# Altium schematic sheet Core&Power.SchDoc
size A3
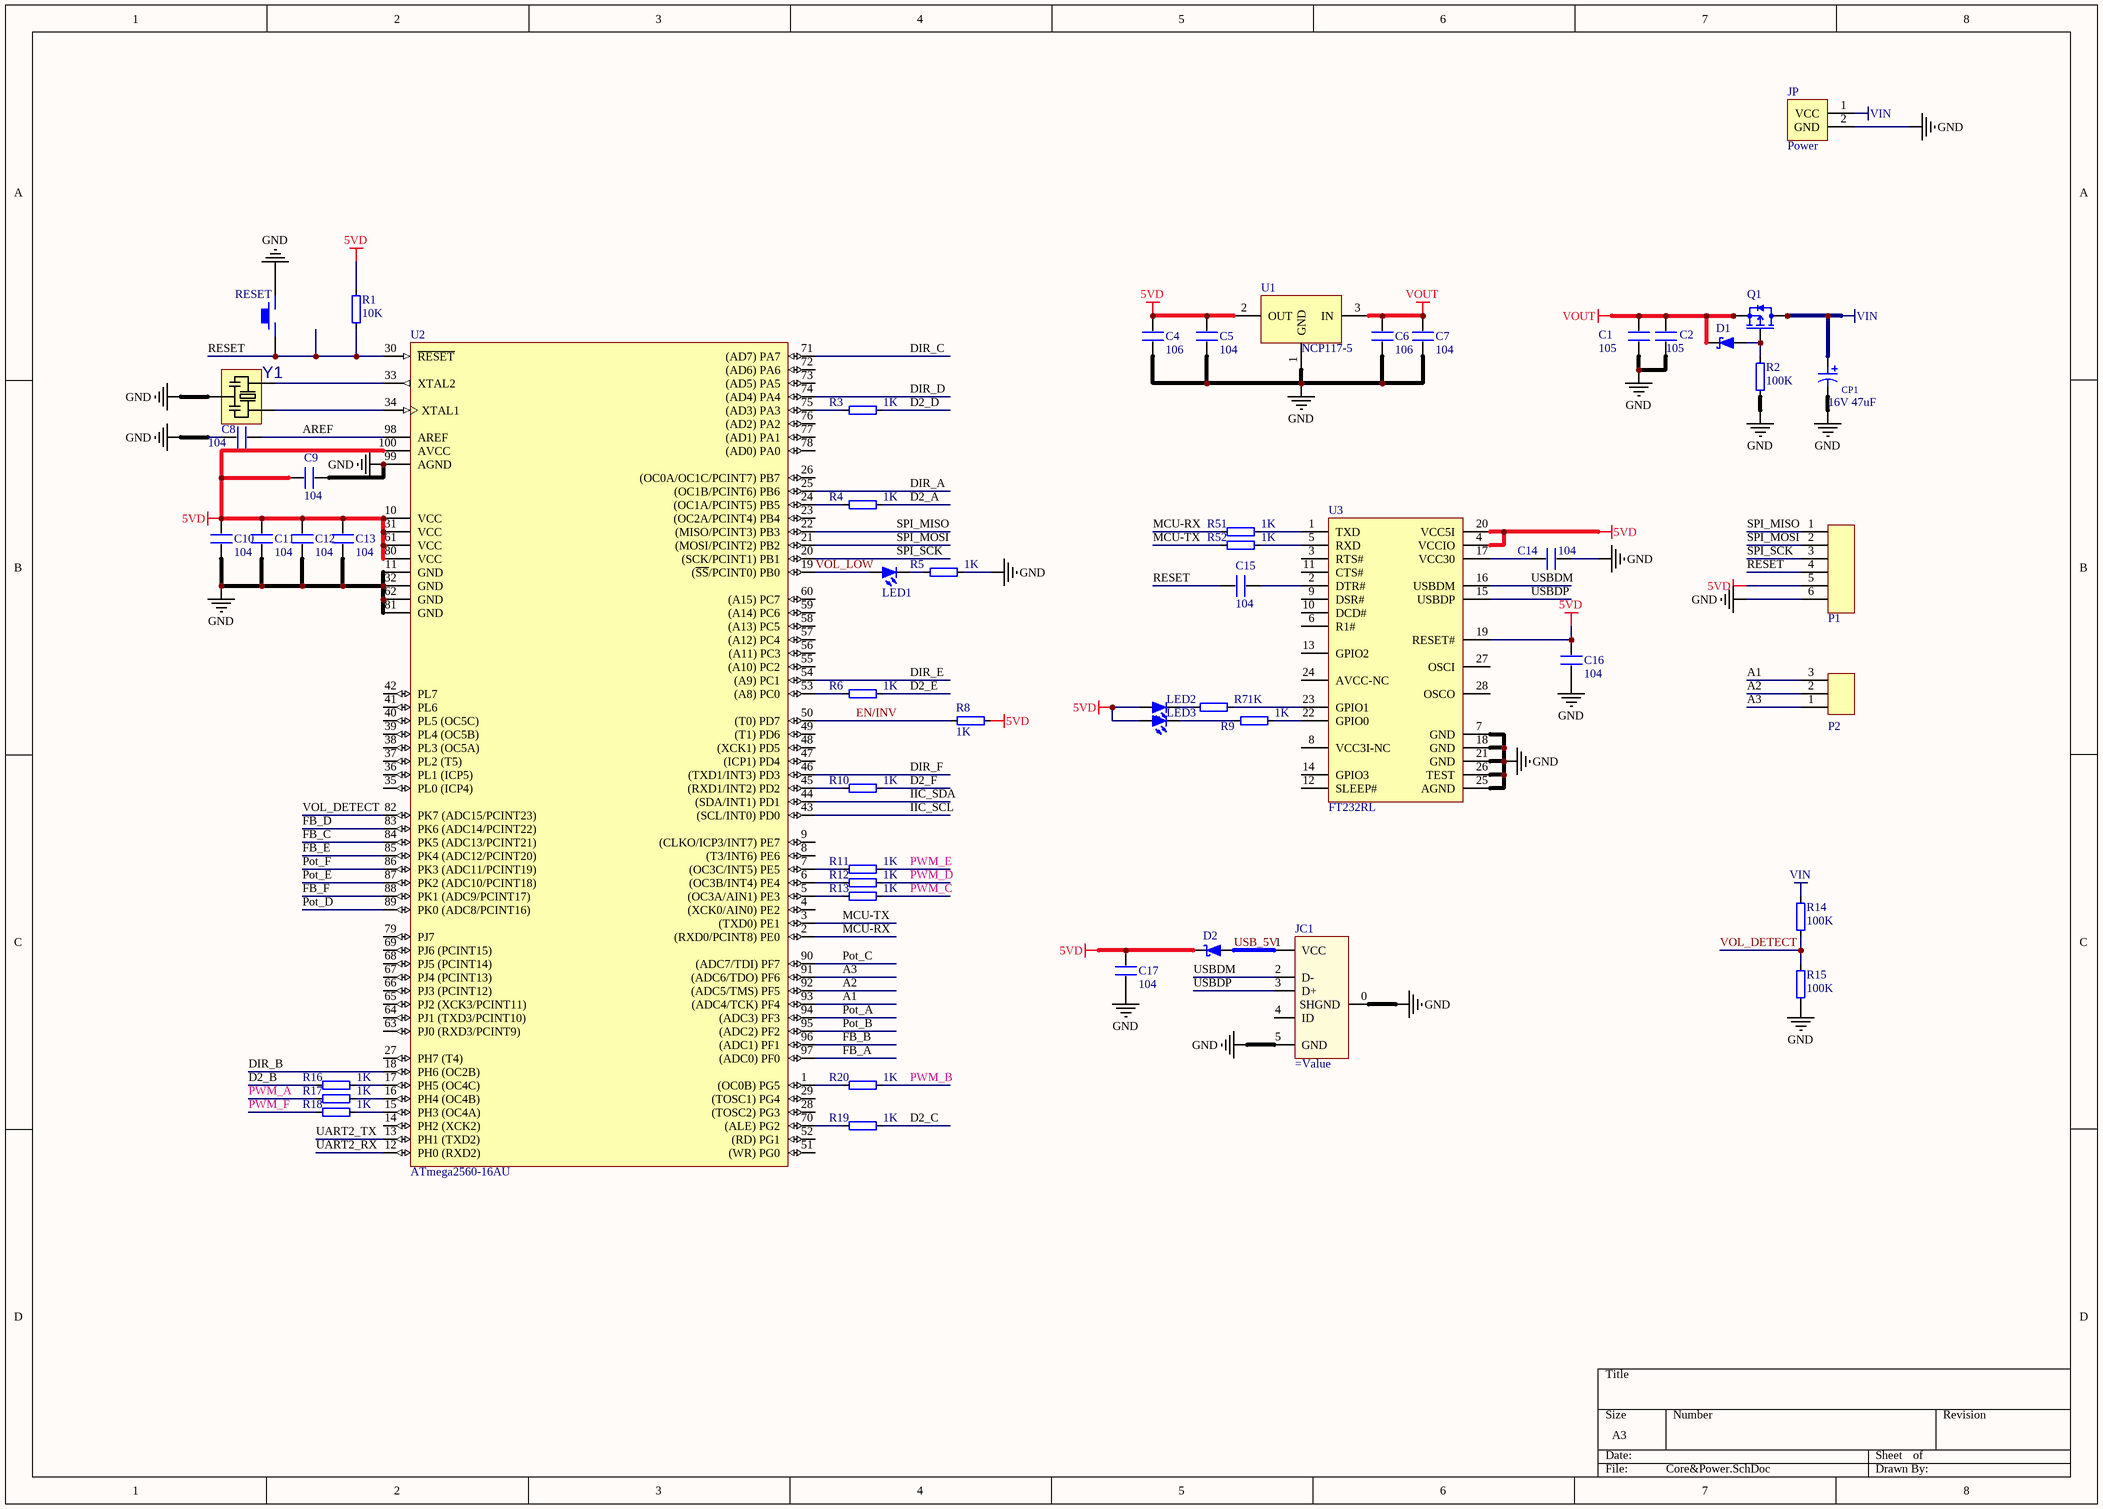
[diagram p0: Core&Power.SchDoc]

## Parts
C1  105  [SM0603C]
C2  105  [SM0603C]
C4  106  [SM0603C]
C5  104  [SM0603C]
C6  106  [SM0603C]
C7  104  [SM0603C]
C8  104  [SM0603C]
C9  104  [SM0603C]
C10  104  [SM0603C]
C11  104  [SM0603C]
C12  104  [SM0603C]
C13  104  [SM0603C]
C14  104  [SM0603C]
C15  104  [SM0603C]
C16  104  [SM0603C]
C17  104  [SM0603C]
CP1  16V 47uF  [SMD5-Al]
D1  B5819W  [SOD-323]  (value not drawn)
D2  B5819W  [SOD-323]  (value not drawn)
JC1  (no value)  [MICRO-USB2]
JP  Power  [AM1015-M]
LED1  Blue LED  [SM0805LED]  (value not drawn)
LED2  Blue LED  [SM0805LED]  (value not drawn)
LED3  Blue LED  [SM0805LED]  (value not drawn)
P1  JC6  [HDR1X6]  (value not drawn)
P2  JC3  [HDR1X3]  (value not drawn)
Q1  (no value)
R1  10K  [SM0603R]
R2  100K  [SM0603R]
R3  1K  [SM0603R]
R4  1K  [SM0603R]
R5  1K  [SM0603R]
R6  1K  [SM0603R]
R7  1K  [SM0603R]
R8  1K  [SM0603R]
R9  1K  [SM0603R]
R10  1K  [SM0603R]
R11  1K  [SM0603R]
R12  1K  [SM0603R]
R13  1K  [SM0603R]
R14  100K  [SM0603R]
R15  100K  [SM0603R]
R16  1K  [SM0603R]
R17  1K  [SM0603R]
R18  1K  [SM0603R]
R19  1K  [SM0603R]
R20  1K  [SM0603R]
R51  1K  [SM0603R]
R52  1K  [SM0603R]
RESET  KEY_M  [SPNO_SMD]  (value not drawn)
U1  NCP117-5  [SOT223-4]
U2  ATmega2560-16AU  [100A_N]
U3  FT232RL  [SSOP-28]
Y1  CSTCE16M0V53-R0  [OSC_CSTCE16M0V53-R0]  (value not drawn)

## Nets
5VD: C4.2 C5.2 C9.2 C10.1 C11.1 C12.1 C13.1 C16.2 C17.2 D2.1(C) LED2.2(A) LED3.2(A) P1.5 R1.2 R8.1 U1.2(OUT) U2.10(VCC) U2.31(VCC) U2.61(VCC) U2.80(VCC) U2.100(AVCC) U3.4(VCCIO) U3.19(RESET#) U3.20(VCC5I)
GND: C1.1 C2.1 C4.1 C5.1 C6.1 C7.1 C8.1 C9.1 C10.2 C11.2 C12.2 C13.2 C14.2 C16.1 C17.1 CP1.2 JC1.0(SHGND) JC1.5(GND) JP.2(GND) P1.6 R2.1 R5.2 R15.1 RESET.1 U1.1(GND) U2.11(GND) U2.32(GND) U2.62(GND) U2.81(GND) U2.99(AGND) U3.7(GND) U3.18(GND) U3.21(GND) U3.25(AGND) U3.26(TEST) Y1.2
VIN: CP1.1 JP.1(VCC) Q1.5(D) Q1.6(D) Q1.7(D) Q1.8(D) R14.2
VOUT: C1.2 C2.2 C6.2 C7.2 D1.1(C) Q1.1(S) Q1.2(S) Q1.3(S) U1.3(IN)
A1: P2.3 U2.93((ADC4/TCK)_PF4)
A2: P2.2 U2.92((ADC5/TMS)_PF5)
A3: P2.1 U2.91((ADC6/TDO)_PF6)
AREF: C8.2 U2.98(AREF)
D2_A: R4.2
D2_B: R16.2
D2_C: R19.2
D2_D: R3.2
D2_E: R6.2
D2_F: R10.2
DIR_A: U2.25((OC1B/PCINT6)_PB6)
DIR_B: U2.18(PH6_(OC2B))
DIR_C: U2.71((AD7)_PA7)
DIR_D: U2.74((AD4)_PA4)
DIR_E: U2.54((A9)_PC1)
DIR_F: U2.46((TXD1/INT3)_PD3)
EN/INV: R8.2 U2.50((T0)_PD7)
FB_A: U2.97((ADC0)_PF0)
FB_B: U2.96((ADC1)_PF1)
FB_C: U2.84(PK5_(ADC13/PCINT21))
FB_D: U2.83(PK6_(ADC14/PCINT22))
FB_E: U2.85(PK4_(ADC12/PCINT20))
FB_F: U2.88(PK1_(ADC9/PCINT17))
IIC_SCL: U2.43((SCL/INT0)_PD0)
IIC_SDA: U2.44((SDA/INT1)_PD1)
MCU-RX: R51.1 U2.2((RXD0/PCINT8)_PE0)
MCU-TX: R52.1 U2.3((TXD0)_PE1)
Pot_A: U2.94((ADC3)_PF3)
Pot_B: U2.95((ADC2)_PF2)
Pot_C: U2.90((ADC7/TDI)_PF7)
Pot_D: U2.89(PK0_(ADC8/PCINT16))
Pot_E: U2.87(PK2_(ADC10/PCINT18))
Pot_F: U2.86(PK3_(ADC11/PCINT19))
PWM_A: R17.1
PWM_B: R20.2
PWM_C: R13.2
PWM_D: R12.2
PWM_E: R11.2
PWM_F: R18.1
RESET: C15.2 P1.4 R1.1 RESET.2 U2.30(~{RESET})
SPI_MISO: P1.1 U2.22((MISO/PCINT3)_PB3)
SPI_MOSI: P1.2 U2.21((MOSI/PCINT2)_PB2)
SPI_SCK: P1.3 U2.20((SCK/PCINT1)_PB1)
UART2_RX: U2.12(PH0_(RXD2))
UART2_TX: U2.13(PH1_(TXD2))
USB_5V: D2.2(A) JC1.1(VCC)
USBDM: JC1.2(D-) U3.16(USBDM)
USBDP: JC1.3(D+) U3.15(USBDP)
VOL_DETECT: R14.1 R15.2 U2.82(PK7_(ADC15/PCINT23))
VOL_LOW: LED1.2(A) U2.19((~{SS}/PCINT0)_PB0)
NetC14_1: C14.1 U3.17(VCC30)
NetC15_1: C15.1 U3.2(DTR#)
NetD1_2: D1.2(A) Q1.4(G) R2.2
NetLED1_1: LED1.1(C) R5.1
NetLED2_1: LED2.1(C) R7.1
NetLED3_1: LED3.1(C) R9.1
NetR3_1: R3.1 U2.75((AD3)_PA3)
NetR4_1: R4.1 U2.24((OC1A/PCINT5)_PB5)
NetR6_1: R6.1 U2.53((A8)_PC0)
NetR7_2: R7.2 U3.23(GPIO1)
NetR9_2: R9.2 U3.22(GPIO0)
NetR10_1: R10.1 U2.45((RXD1/INT2)_PD2)
NetR11_1: R11.1 U2.7((OC3C/INT5)_PE5)
NetR12_1: R12.1 U2.6((OC3B/INT4)_PE4)
NetR13_1: R13.1 U2.5((OC3A/AIN1)_PE3)
NetR16_1: R16.1 U2.17(PH5_(OC4C))
NetR17_2: R17.2 U2.16(PH4_(OC4B))
NetR18_2: R18.2 U2.15(PH3_(OC4A))
NetR19_1: R19.1 U2.70((ALE)_PG2)
NetR20_1: R20.1 U2.1((OC0B)_PG5)
NetR51_2: R51.2 U3.1(TXD)
NetR52_2: R52.2 U3.5(RXD)
NetU2_33: U2.33(XTAL2) Y1.3
NetU2_34: U2.34(XTAL1) Y1.1

Not connected (* = marked no-connect by the designer): JC1 4(ID); U2 4((XCK0/AIN0)_PE2) 8((T3/INT6)_PE6) 9((CLKO/ICP3/INT7)_PE7) 14(PH2_(XCK2)) 23((OC2A/PCINT4)_PB4) 26((OC0A/OC1C/PCINT7)_PB7) 27(PH7_(T4)) 28((TOSC2)_PG3) 29((TOSC1)_PG4) 35(PL0_(ICP4)) 36(PL1_(ICP5)) 37(PL2_(T5)) 38(PL3_(OC5A)) 39(PL4_(OC5B)) 40(PL5_(OC5C)) 41(PL6) 42(PL7) 47((ICP1)_PD4) 48((XCK1)_PD5) 49((T1)_PD6) 51((WR)_PG0) 52((RD)_PG1) 55((A10)_PC2) 56((A11)_PC3) 57((A12)_PC4) 58((A13)_PC5) 59((A14)_PC6) 60((A15)_PC7) 63(PJ0_(RXD3/PCINT9)) 64(PJ1_(TXD3/PCINT10)) 65(PJ2_(XCK3/PCINT11)) 66(PJ3_(PCINT12)) 67(PJ4_(PCINT13)) 68(PJ5_(PCINT14)) 69(PJ6_(PCINT15)) 72((AD6)_PA6) 73((AD5)_PA5) 76((AD2)_PA2) 77((AD1)_PA1) 78((AD0)_PA0) 79(PJ7); U3 3(RTS#) 6(R1#) 8(VCC3I-NC) 9(DSR#) 10(DCD#) 11(CTS#) 12(SLEEP#) 13(GPIO2) 14(GPIO3) 24(AVCC-NC) 27(OSCI) 28(OSCO)

## Library data of the parts
C1 C2 C4-C17 = C
CP1 = 2.1.2.50.5162200: Cap, 22uF, 20%, 16V; Manufactory: ALUMINUM; InstallMode: SMD; Install: *; Value: 16V 47uF
D1 D2 = 2.1.4.21.0058190: Dio, Schottky, B5819W, 1A, 40V, SOD123, SSC; Manufactory: Silicon Standard Corp.; InstallMode: SMD; Install: *; Part Number: 2.1.4.21.0058190; Name: B5819W; Value: B5819W; HelpURL: http://doc.digimagus.net/doc/4 极管类/21 肖特基二极管/2.1.4.21.00581x0(B5817W-B5819W).pdf
JC1 = 2.1.7.20.6780302: Mini USB Jack, SD-67803-002, Molex; Install: *; Part Number: 2.1.7.20.6780302
LED1-LED3 = 2.1.4.10.0060330: LED, Blue, 5mA, 0603; Manufactory: Everlight Electronics Co., Ltd.; Name: Blue LED[0603]; InstallMode: SMD; Install: *; Part Number: 2.1.4.10.0060330; Value: Blue LED; HelpURL: http://doc.digimagus.net/doc/4 极管类/10 贴片LED/2.1.4.10.0060330(LED_Blue_0603).pdf
Q1 = IRF7842: Mos/P; InstallMode: SMD
R1-R20 R51 R52 = RES
U2 = ATmega2560-16AU: 8-bit AVR Microcontroller, 4.5-5.5V, 256KB Flash, 4KB EEPROM, 8KB SRAM, 86 GPIO pins, 100-pin TQFP, Industrial Grade (-40癈 to 85癈), Pb-Free; Published: 1-Apr-2010; DatasheetVersion: revL, Aug-2007; PackageVersion: revC, Oct-2001; PackageReference: 100A; Publisher: Altium Limited; PackageDescription: 100-Pin Thin Profile Plastic Quad Flat Pack (TQFP), 14 x 14 x 1.0 mm Body, 0.5 mm Pitch; Supplier 1: Digi-Key; Supplier Part Number 1: ATMEGA2560-16AU-ND; Supplier 2: Farnell; Supplier Part Number 2: 1288330; Supplier 3: Farnell; Supplier Part Number 3: 1661740; Supplier 4: Mouser; Supplier Part Number 4: 556-ATMEGA2560-16AU; Code_JEDEC: MS-026-AED; ComponentLink1Description: Manufacturer Link; ComponentLink1URL: http://www.atmel.com/products/avr/default.asp?; ComponentLink2Description: ATmega640/1280/1281/2560/2561 Datasheet; ComponentLink2URL: http://www.atmel.com/dyn/resources/prod_documents/doc2549.pdf; ComponentLink3Description: ATmega640/1280/1281/2560/2561 Summary; ComponentLink3URL: http://www.atmel.com/dyn/resources/prod_documents/2549S.pdf; ComponentLink4Description: Atmel.com Home; ComponentLink4URL: http://www.atmel.com
Y1 = CSTCE16M0V53-R0: Ceramic Resonator 16MHz ??0.5% (Tol) ??0.3% (Stability) 15pF 40Ohm 3-Pin CSMD T/R; MF: Murata; MP: CSTCE16M0V53-R0; Package: SMD-3 Murata; Price: 0.30 USD; Availability: Good